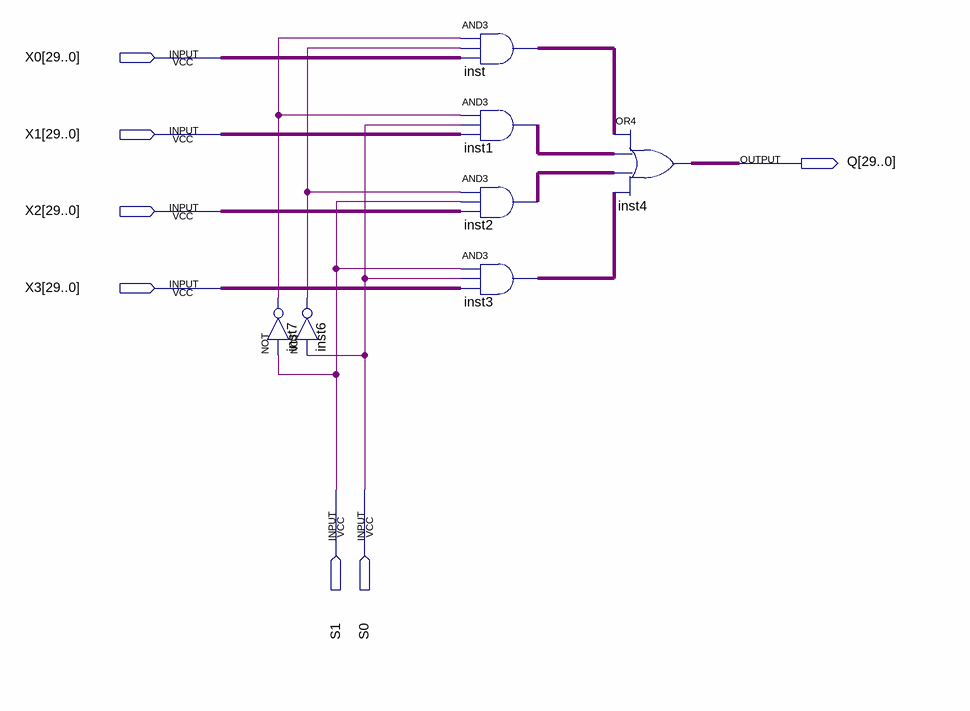
[diagram p0: schematic sheet]
// Quartus schematic mux4.bdf as structural Verilog: 7 symbols, 7 pins
module mux4 (
  input  [29:0] X0,
  input  [29:0] X1,
  input  [29:0] X2,
  input  [29:0] X3,
  input  S1,
  input  S0,
  output [29:0] Q
);

  wire inst6_out, inst7_out;
  wire [29:0] inst1_out, inst2_out, inst3_out, inst_out;

  not inst6 (inst6_out, S0);
  not inst7 (inst7_out, S1);
  assign inst_out = {30{inst7_out}} & {30{inst6_out}} & X0;  // AND3 inst, 30 bits wide
  assign inst1_out = {30{inst7_out}} & {30{S0}} & X1;  // AND3 inst1, 30 bits wide
  assign inst2_out = {30{inst6_out}} & {30{S1}} & X2;  // AND3 inst2, 30 bits wide
  assign inst3_out = {30{S1}} & {30{S0}} & X3;  // AND3 inst3, 30 bits wide
  assign Q = inst_out | inst1_out | inst2_out | inst3_out;  // OR4 inst4, 30 bits wide
endmodule
